# Altium schematic sheet Power.SchDoc: Power
size Letter; Revision: 1.0; SheetNumber: 7; PageSetup: Record=PageOptions|CenterHorizontal=True|CenterVertical=True|PrintScale=1.00|XCorrection=1.00|YCorrection=1.00|PrintKind=1|BorderSize=5000000|LeftOffset=0|BottomOffset=0|Orientation=2|PaperLength=1000|PaperWidth=1000|Scale=100|PaperSource=7|PrintQuality=-3|MediaType=1|DitherType=10|PrintScaleMode=1|PaperKind=Letter|PaperIndex=1; ProjectTitle: Data Acquisition System
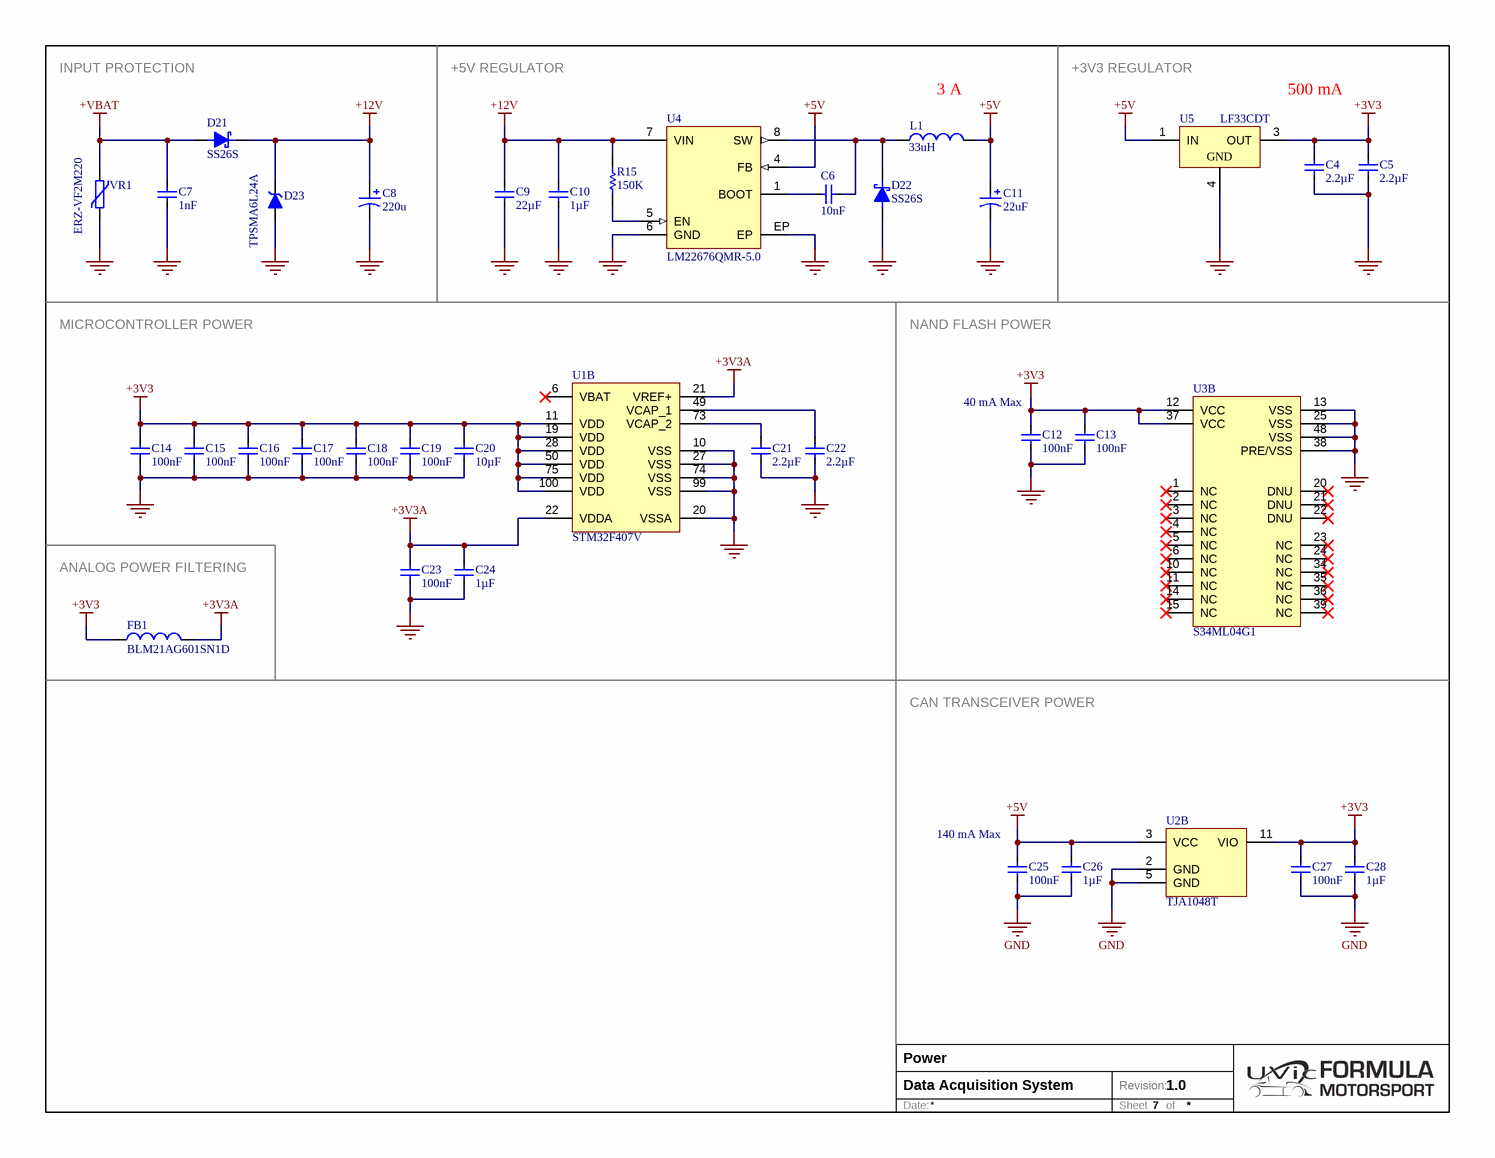
[diagram p0: Power.SchDoc]

## Parts
C4  value 2.2µF  [CAP-0805-M]  (hidden comment: Capacitor 2.2µF 10V 0805)
C5  value 2.2µF  [CAP-0805-M]  (hidden comment: Capacitor 2.2µF 10V 0805)
C6  value 10nF  [CAP-0603-M]  (hidden comment: Capacitor 10nF 50V 0603)
C7  value 1nF  [CAP-0805-M]  (hidden comment: Capacitor 1nF 50V 0805)
C8  value 220u  [CAPAE9083X70M]  (hidden comment: PCR1E221MCL1GS)
C9  value 22µF  [CAP-1210-M]  (hidden comment: Capacitor 22µF 25V 1210)
C10  value 1µF  [CAP-0805-M]  (hidden comment: Capacitor 1µF 16V 0805)
C11  value 22uF  [CAP-B1]  (hidden comment: 8TPC22M)
C12  value 100nF  [CAP-0603-M]  (hidden comment: Capacitor 100nF 25V 0603)
C13  value 100nF  [CAP-0603-M]  (hidden comment: Capacitor 100nF 25V 0603)
C14  value 100nF  [CAP-0603-M]  (hidden comment: Capacitor 100nF 25V 0603)
C15  value 100nF  [CAP-0603-M]  (hidden comment: Capacitor 100nF 25V 0603)
C16  value 100nF  [CAP-0603-M]  (hidden comment: Capacitor 100nF 25V 0603)
C17  value 100nF  [CAP-0603-M]  (hidden comment: Capacitor 100nF 25V 0603)
C18  value 100nF  [CAP-0603-M]  (hidden comment: Capacitor 100nF 25V 0603)
C19  value 100nF  [CAP-0603-M]  (hidden comment: Capacitor 100nF 25V 0603)
C20  value 10µF  [CAP-0805-M]  (hidden comment: Capacitor 10µF 10V 0805)
C21  value 2.2µF  [CAP-0805-M]  (hidden comment: Capacitor 2.2µF 10V 0805)
C22  value 2.2µF  [CAP-0805-M]  (hidden comment: Capacitor 2.2µF 10V 0805)
C23  value 100nF  [CAP-0603-M]  (hidden comment: Capacitor 100nF 25V 0603)
C24  value 1µF  [CAP-0805-M]  (hidden comment: Capacitor 1µF 16V 0805)
C25  value 100nF  [CAP-0603-M]  (hidden comment: Capacitor 100nF 25V 0603)
C26  value 1µF  [CAP-0805-M]  (hidden comment: Capacitor 1µF 16V 0805)
C27  value 100nF  [CAP-0603-M]  (hidden comment: Capacitor 100nF 25V 0603)
C28  value 1µF  [CAP-0805-M]  (hidden comment: Capacitor 1µF 16V 0805)
D21  SS26S  [DO-214AC (SMA)]
D22  SS26S  [DO-214AC (SMA)]
D23  TPSMA6L24A  [SODFL520X110-2N]
FB1  BLM21AG601SN1D  [MURA-BLM21A]
L1  value 33uH  [INDP125125X65N]  (hidden comment: SRR1260A-330M)
R15  value 150K  [RES-0603-M]  (hidden comment: Resistor 150K 1/10 W 0603)
U1  STM32F407V  [100-LQFP-14x14-0.5]  (part B of 2)
U2  TJA1048T  [SOP127P600X175-14N]  (part B of 2)
U3  S34ML04G1  [48-TSOP]  (part B of 2)
U4  LM22676QMR-5.0  [8-SOIC-EP-4.9x3.9mm]
U5  LF33CDT  [TO-252_M]
VR1  ERZ-VF2M220  [ERZ-VF]

## Nets
+3V3: C4.2 C5.2 C12.1 C13.1 C14.1 C15.1 C16.1 C17.1 C18.1 C19.1 C20.1 C27.1 C28.2 FB1.1 U1.11(VDD) U1.19(VDD) U1.28(VDD) U1.50(VDD) U1.75(VDD) U1.100(VDD) U2.11(VIO) U3.12(VCC) U3.37(VCC) U5.3(OUT)
+3V3A: C23.1 C24.2 FB1.2 U1.21(VREF+) U1.22(VDDA)
+5V: C11.1 C25.1 C26.2 L1.2 U2.3(VCC) U4.4(FB) U5.1(IN)
+12V: C8.1 C9.2 C10.2 D21.1(K) D23.1(A) R15.2 U4.7(VIN)
+VBAT: C7.2 D21.2(A) VR1.2
GND: C4.1 C5.1 C7.1 C8.2 C9.1 C10.1 C11.2 C12.2 C13.2 C14.2 C15.2 C16.2 C17.2 C18.2 C19.2 C20.2 C21.1 C22.1 C23.2 C24.1 C25.2 C26.1 C27.2 C28.1 D22.2(A) D23.2(C) U1.10(VSS) U1.20(VSSA) U1.27(VSS) U1.74(VSS) U1.99(VSS) U2.2(GND) U2.5(GND) U3.13(VSS) U3.25(VSS) U3.38(PRE/VSS) U3.48(VSS) U4.6(GND) U4.EP U5.4(GND) VR1.1
NetC6_1: C6.1 U4.1(BOOT)
NetC6_2: C6.2 D22.1(K) L1.1 U4.8(SW)
NetC21_2: C21.2 U1.73(VCAP_2)
NetC22_2: C22.2 U1.49(VCAP_1)
NetR15_1: R15.1 U4.5(EN)

Not connected (* = marked no-connect by the designer): U1 6(VBAT)*; U3 1(NC)* 2(NC)* 3(NC)* 4(NC)* 5(NC)* 6(NC)* 10(NC)* 11(NC)* 14(NC)* 15(NC)* 20(DNU)* 21(DNU)* 22(DNU)* 23(NC)* 24(NC)* 34(NC)* 35(NC)* 36(NC)* 39(NC)*; U4 2(NC) 3(NC)

## Notes on the sheet
- INPUT PROTECTION
- +5V REGULATOR
- (near L1) 3 A
- +3V3 REGULATOR
- 500 mA
- MICROCONTROLLER POWER
- NAND FLASH POWER
- (near C12) 40 mA Max
- ANALOG POWER FILTERING
- CAN TRANSCEIVER POWER
- (near C25) 140 mA Max
- Date:
- Revision:
- Sheet
- of

## Library data of the parts
C4 C5 C21 C22 = CC0805KKX7R6BB225: Manufacturer: Yageo; Manufacturer Series: CC; Tolerance: ±10%; Temperature Coefficient: X7R; Part Number: CC0805KKX7R6BB225; Component Type: Standard; Voltage: 10V; Package: 0805; Temperature Range: -55°C ~ 125°C; Supplier 1: Digi-Key; Supplier Part Number 1: 311-1368-1-ND
C6 = CC0603KRX7R9BB103: Manufacturer: Yageo; Manufacturer Series: CC; Tolerance: ±10%; Temperature Coefficient: X7R; Part Number: CC0603KRX7R9BB103; Component Type: Standard; Voltage: 50V; Package: 0603; Temperature Range: -55°C ~ 125°C; Supplier 1: Digi-Key; Supplier Part Number 1: 311-1085-1-ND
C7 = CC0805KRX7R9BB102: Manufacturer: Yageo; Manufacturer Series: CC; Tolerance: ±10%; Temperature Coefficient: X7R; Part Number: CC0805KRX7R9BB102; Component Type: Standard; Voltage: 50V; Package: 0805; Temperature Range: -55°C ~ 125°C; Supplier 1: Digi-Key; Supplier Part Number 1: 311-1127-1-ND
C8 = PCR1E221MCL1GS: SMD Polymer Electrolytic Capacitor; Supplier 1: Digi-Key; Supplier Part Number 1: 493-13752-1-ND
C9 = CC1210KKX7R8BB226: Manufacturer: Yageo; Manufacturer Series: CC; Tolerance: ±10%; Temperature Coefficient: X7R; Part Number: CC1210KKX7R8BB226; Component Type: Standard; Voltage: 25V; Package: 1210; Temperature Range: -55°C ~ 125°C; Supplier 1: Digi-Key; Supplier Part Number 1: 311-2032-1-ND
C10 C24 C26 C28 = CC0805KKX7R7BB105: Manufacturer: Yageo; Manufacturer Series: CC; Tolerance: ±10%; Temperature Coefficient: X7R; Part Number: CC0805KKX7R7BB105; Component Type: Standard; Voltage: 16V; Package: 0805; Temperature Range: -55°C ~ 125°C; Supplier 1: Digi-Key; Supplier Part Number 1: 311-1365-1-ND
C11 = 8TPC22M: CAP TANT 22UF 8V 20% B1; Supplier 1: Digi-Key; Supplier Part Number 1: P16219CT-ND
C12-C19 C23 C25 C27 = CC0603KRX7R8BB104: Manufacturer: Yageo; Manufacturer Series: CC; Tolerance: ±10%; Temperature Coefficient: X7R; Part Number: CC0603KRX7R8BB104; Component Type: Standard; Voltage: 25V; Package: 0603; Temperature Range: -55°C ~ 125°C; Supplier 1: Digi-Key; Supplier Part Number 1: 311-1341-1-ND
C20 = CC0805KKX5R6BB106: Manufacturer: Yageo; Manufacturer Series: CC; Tolerance: ±10%; Temperature Coefficient: X5R; Part Number: CC0805KKX5R6BB106; Component Type: Standard; Voltage: 10V; Package: 0805; Temperature Range: -55°C ~ 85°C; Supplier 1: Digi-Key; Supplier Part Number 1: 311-1460-1-ND
D21 D22 = SS26S: SMD Schottky Diode; Supplier 1: Digi-Key; Supplier Part Number 1: 475-1278-1-ND
D23 = TPSMA6L24A: SMD TVS Diode; Supplier 1: Digi-Key; Supplier Part Number 1: F6148CT-ND
FB1 = BLM21AG601SN1D: Chip Ferrite Bead (0805) 600R at 100MHz; Supplier 1: Digi-Key; Supplier Part Number 1: 490-1040-1-ND
L1 = SRR1260A-330M: SRR1260 Shield SMD Power Inductor; Supplier 1: Digi-Key; Supplier Part Number 1: SRR1260A-330MCT-ND
R15 = RC0603FR-07150KL: Manufacturer: Yageo; Manufacturer Series: RC; Tolerance: 1%; Power: 1/10 W; Temperature Coefficient: ±100ppm/°C; Part Number: RC0603FR-07150KL; Component Type: Standard; Package: 0603; Temperature Range: -55°C ~ 155°C; Supplier 1: Digi-Key; Supplier Part Number 1: 311-150KHRCT-ND
U1 = STM32F407V: STM32F407 100-LQFP; Supplier 1: Digi-Key; Supplier Part Number 1: 497-11605-ND
U2 = TJA1048T: Dual CAN transceiver; Supplier 1: Digi-Key; Supplier Part Number 1: 568-8681-1-ND
U5 = LF33CDT: LDO Fixed 3.3 Automotive; Supplier 1: Digi-Key; Supplier Part Number 1: 497-1532-1-ND
VR1 = ERZ-VF2M220: SMD Varistor 22V; Supplier 1: Digi-Key; Supplier Part Number 1: P7345CT-ND
U4 = LM22676QMR-5.0: Supplier 1: Digi-Key; Supplier Part Number 1: LM22676QMR-5.0/NOPB-ND